# EAGLE schematic FETCHAR (EAGLE 8.4.2)
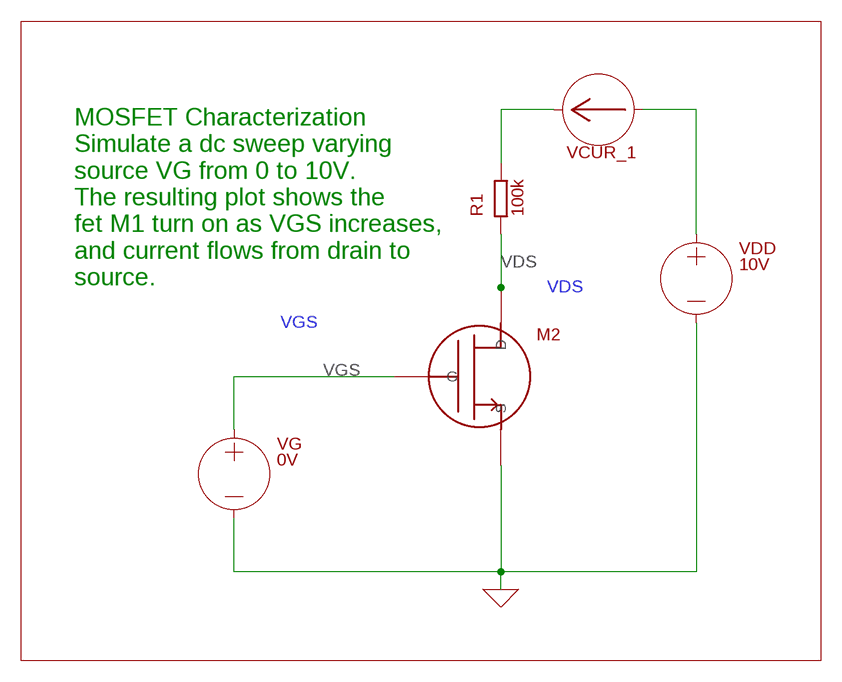
[diagram p0: schematic, sheet 1]

## Parts
M2  FET_N  (no package)
R1  100k  R  (no package)
VCUR_1  0V  AMMETER  (no package)
VDD  10V  VOLTAGE  (no package)
VG  0V  VOLTAGE  (no package)

## Nets
0: M2.S VDD.- VG.- ; supply symbol labelled GND
N$2: R1.2 VCUR_1.-
N$3: VCUR_1.+ VDD.+
VDS: M2.D R1.1
VGS: M2.G VG.+

## Notes on the sheet
- MOSFET Characterization
  Simulate a dc sweep varying
  source VG from 0 to 10V.
  The resulting plot shows the
  fet M1 turn on as VGS increases,
  and current flows from drain to
  source.

## Library data of the parts
M2 = ngspice-simulation:FET_N: N-Type MOS Field Effect Transistor (MOSFET)
R1 = ngspice-simulation:R: RESISTOR
VCUR_1 = ngspice-simulation:AMMETER: AMMETER
VDD = ngspice-simulation:VOLTAGE: Independent Voltage Source, either DC, AC, PULSE, SINE, PWL, EXP, or SFFM; VALUE: 0V
VG = ngspice-simulation:VOLTAGE: Independent Voltage Source, either DC, AC, PULSE, SINE, PWL, EXP, or SFFM